# EAGLE design watch_v1_light-addon (EAGLE 9.6.2)
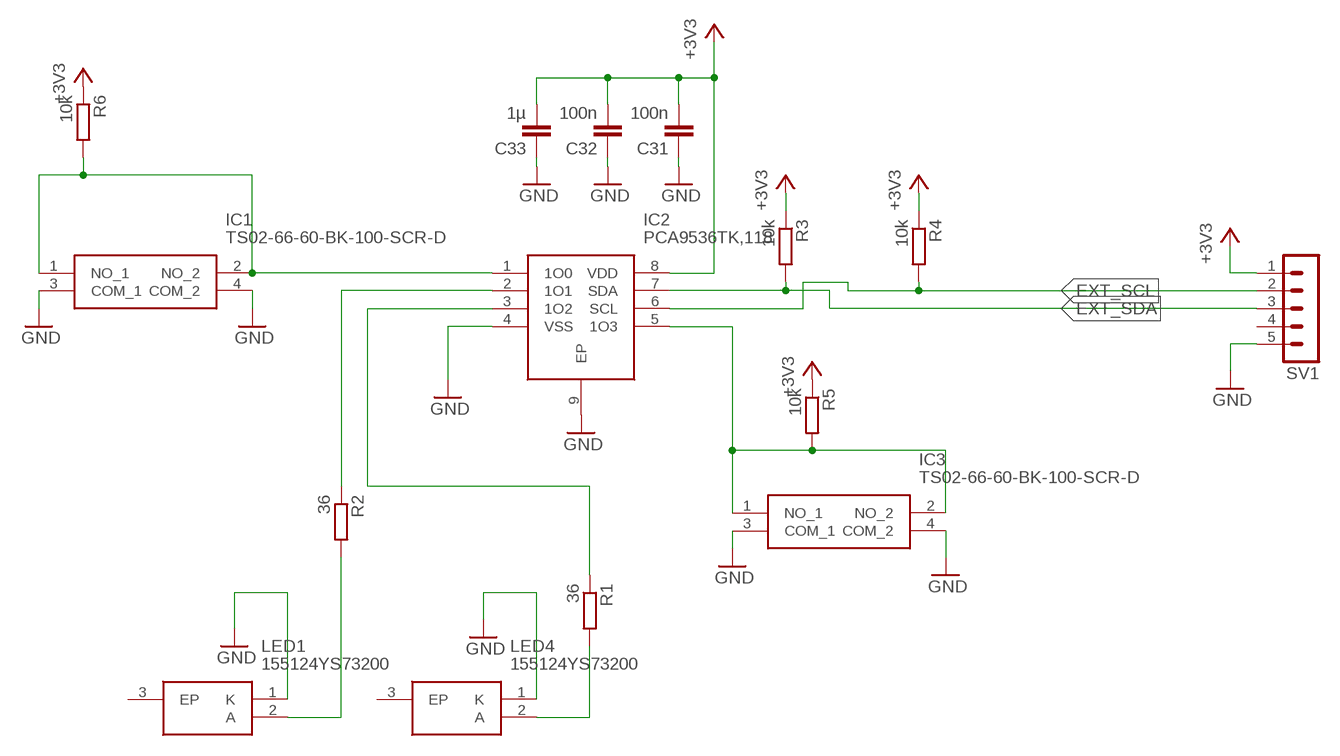
[diagram p0: schematic, sheet 1]

## Parts
C31  100n  C0402_S  [C0402_S]
C32  100n  C0402_S  [C0402_S]
C33  1µ  C0402_S  [C0402_S]
IC1  TS02-66-60-BK-100-SCR-D  [TS026660BK100SCRD]
IC2  PCA9536TK,118  [SON50P300X300X100-9N]
IC3  TS02-66-60-BK-100-SCR-D  [TS026660BK100SCRD]
LED1  155124YS73200  [155124YS73200]
LED4  155124YS73200  [155124YS73200]
R1  36  R0402  [R0402]
R2  36  R0402  [R0402]
R3  10k  R0402  [R0402]
R4  10k  R0402  [R0402]
R5  10k  R0402  [R0402]
R6  10k  R0402  [R0402]
SV1  MA05-1  [MA05-1]

## Nets
+3V3: C31.P$2 C32.P$2 C33.P$2 IC2.8(VDD) R3.1 R4.1 R5.1 R6.1 SV1.1
EXT_SCL: IC2.6(SCL) R4.2 SV1.2
EXT_SDA: IC2.7(SDA) R3.2 SV1.3
GND: C31.P$1 C32.P$1 C33.P$1 IC1.3(COM_1) IC1.4(COM_2) IC2.4(VSS) IC2.9(EP) IC3.3(COM_1) IC3.4(COM_2) LED1.1(K) LED4.1(K) SV1.5
N$1: IC1.1(NO_1) IC1.2(NO_2) IC2.1(1O0) R6.2
N$2: IC2.2(1O1) R2.1
N$3: LED4.2(A) R1.2
N$4: LED1.2(A) R2.2
N$5: IC2.3(1O2) R1.1
N$7: IC2.5(1O3) IC3.1(NO_1) IC3.2(NO_2) R5.2
Unconnected: LED1.3(EP) LED4.3(EP) SV1.4

## Library data of the parts
C31-C33 = moekoe_rcl:C0402
IC1 IC3 = TS02-66-60-BK-100-SCR-D:TS02-66-60-BK-100-SCR-D: 6 x 6 mm, 6 mm Actuator Height, 100 gf, Black, Short Crimped, Through Hole, SPST, Tactile Switch Source: Datasheet <https://www.sameskydevices.com/product/resource/ts02.pdf>; DESCRIPTION: 6 x 6 mm, 6 mm Actuator Height, 100 gf, Black, Short Crimped, Through Hole, SPST, Tactile Switch; HEIGHT: 6.2mm; MANUFACTURER_NAME: Same Sky; MANUFACTURER_PART_NUMBER: TS02-66-60-BK-100-SCR-D; MOUSER_PART_NUMBER: 179-TS026660BK100SCR; MOUSER_PRICE-STOCK: https://www.mouser.co.uk/ProductDetail/Same-Sky/TS02-66-60-BK-100-SCR-D?qs=A6eO%252BMLsxmRCwE7519dLfw%3D%3D
IC2 = PCA9536TK_118:PCA9536TK,118: NXP - PCA9536TK,118 - I/O EXPANDER, 4BIT, 400KHZ, HVSON-8 Source: Datasheet <http://www.nxp.com/docs/en/data-sheet/PCA9536.pdf>; DESCRIPTION: NXP - PCA9536TK,118 - I/O EXPANDER, 4BIT, 400KHZ, HVSON-8; HEIGHT: 1mm; MANUFACTURER_NAME: NXP; MANUFACTURER_PART_NUMBER: PCA9536TK,118; MOUSER_PART_NUMBER: 771-PCA9536TK118; MOUSER_PRICE-STOCK: https://www.mouser.co.uk/ProductDetail/NXP-Semiconductors/PCA9536TK118?qs=LOCUfHb8d9uivcmK3VR1%2Fw%3D%3D
LED1 LED4 = 155124YS73200:155124YS73200: Wurth Elektronik 155124YS73200, WL-SMSW Series Yellow LED, 589 nm, 3210 (1204), Round Lens SMD Package Source: Datasheet <https://www.we-online.com/catalog/datasheet/155124YS73200.pdf>; DESCRIPTION: Wurth Elektronik 155124YS73200, WL-SMSW Series Yellow LED, 589 nm, 3210 (1204), Round Lens SMD Package; HEIGHT: 1.2mm; MANUFACTURER_NAME: Wurth Elektronik; MANUFACTURER_PART_NUMBER: 155124YS73200; MOUSER_PART_NUMBER: 710-155124YS73200; MOUSER_PRICE-STOCK: https://www.mouser.co.uk/ProductDetail/Wurth-Elektronik/155124YS73200?qs=LlUlMxKIyB21jUIV%252Bh2Pcg%3D%3D
R1-R6 = moekoe_rcl:R0402
SV1 = con-lstb:MA05-1: PIN HEADER; OC_FARNELL: unknown; OC_NEWARK: unknown

## Board
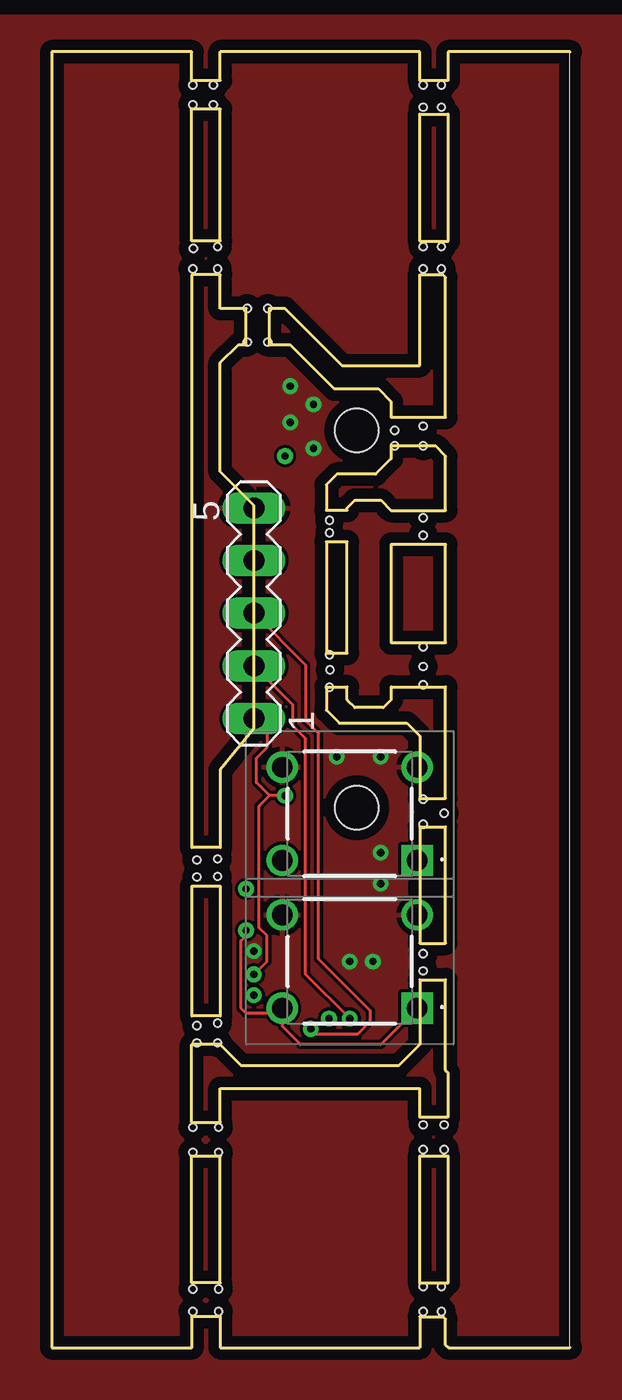
[diagram p1: board, top side]
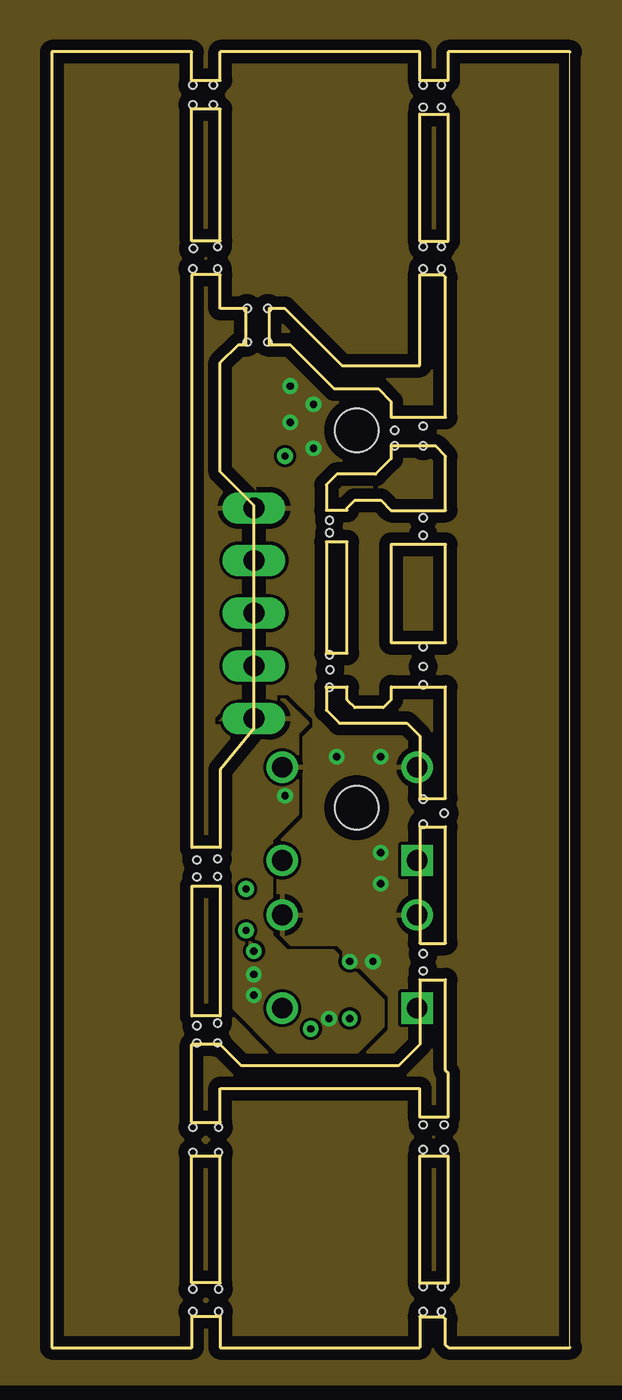
[diagram p2: board, inner layer Route2]
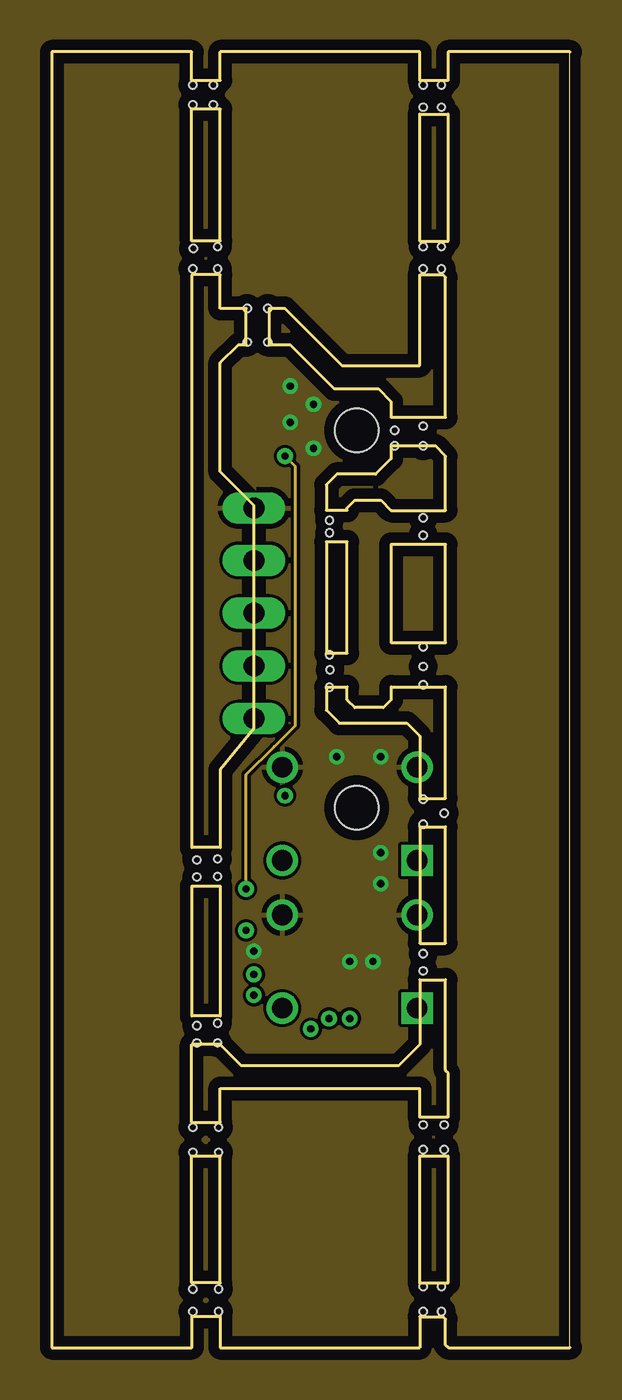
[diagram p3: board, inner layer Route15]
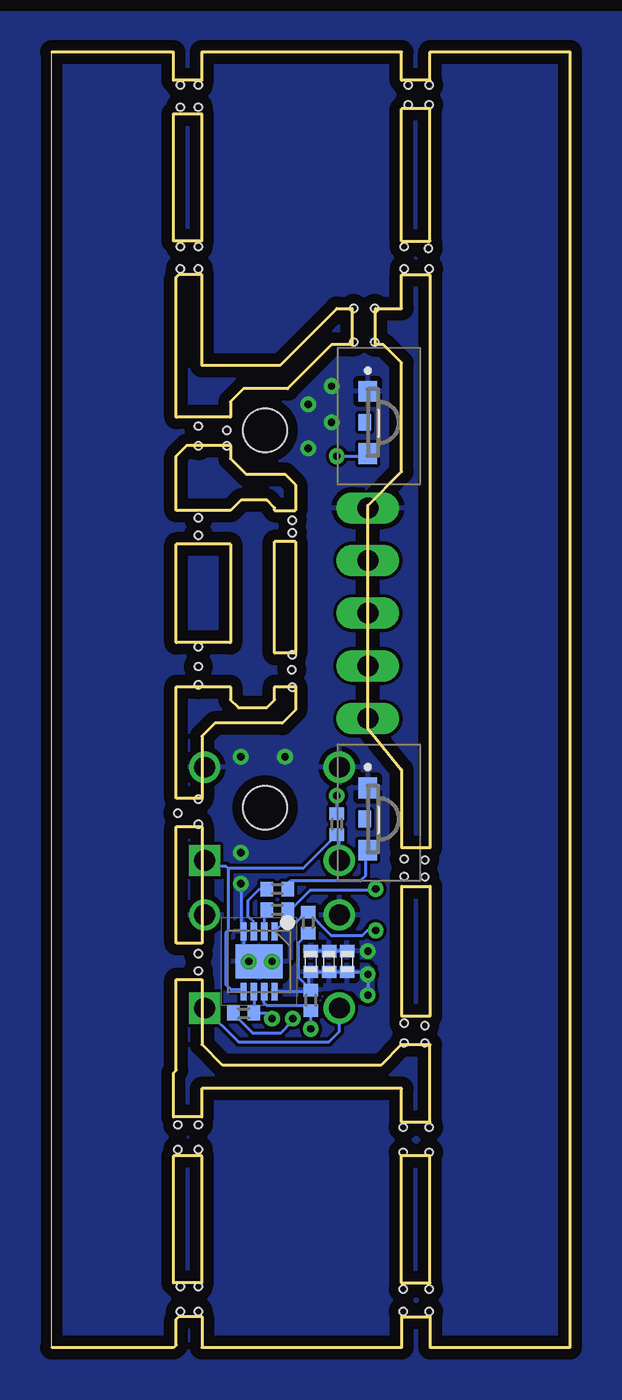
[diagram p4: board, bottom side, seen from below]

Size 25 x 62.5 mm. Coordinates in mm from the lower left corner, seen from the top.
Outline: 9.75,29.88 9.75,40.62 8.12,42.25 8.12,47.5 9,48.38 9.38,48.38 9.38,50.12 8.12,50.12 8.12,51.75 6.75,51.75 6.75,24.12 8.12,24.12 8.12,27.88 9.75,29.88
Outline: 8.12,22.25 8.12,16 6.75,16 6.75,22.25 8.12,22.25
Outline: 10.5,48.38 11.5,48.38 13.62,46.25 15.75,46.25 16.38,45.62 16.38,44.88 19,44.88 19,51.62 18.88,51.75 17.75,51.75 17.75,47.38 14,47.38 11.25,50.12 10.5,50.12 10.5,48.38
Outline: 16.38,43.5 16.38,42.88 15.62,42.12 13.75,42.12 13.25,41.62 13.25,40.38 14.25,40.38 14.25,40.5 14.62,40.88 15.88,40.88 16.38,40.38 19,40.38 19,43 18.5,43.5 16.38,43.5
Outline: 13.88,30.12 17.12,30.12 17.75,29.5 17.75,26.5 19,26.5 19,31.88 16.38,31.88 16.38,31.25 16,30.88 14.62,30.88 14.25,31.25 14.25,31.88 13.25,31.88 13.25,30.75 13.88,30.12
Outline: 13.25,38.88 13.25,33.5 14.25,33.5 14.25,38.88 13.25,38.88
Outline: 8.12,14.62 9.12,13.62 16.75,13.62 17.75,14.62 17.75,17.75 19,17.75 19,13.38 19.12,13.25 19.12,11.12 17.75,11.12 17.75,12.5 8.12,12.5 8.12,10.88 6.75,10.88 6.75,14.62 8.12,14.62
Outline: 17.75,25.12 17.75,19.5 19,19.5 19,25.12 17.75,25.12
Outline: 0,62.5 0,0 6.75,0 6.75,1.5 8.12,1.5 8.12,0 17.75,0 17.75,1.5 18.88,1.5 19,1.38 19,0.12 19.12,0 25,0 25,62.5 19.12,62.5 19.12,61.12 17.75,61.12 17.75,62.5 8.12,62.5 8.12,61.12 6.75,61.12 6.75,62.5 0,62.5
Outline: 19,34 19,38.75 16.38,38.75 16.38,34 19,34
Outline: 17.75,53.38 17.75,59.5 19.12,59.5 19.12,53.38 17.75,53.38
Outline: 6.75,53.38 6.75,59.75 8.12,59.75 8.12,53.38 6.75,53.38
Outline: 17.75,3.12 17.75,9.25 19.12,9.25 19.12,3.12 17.75,3.12
Outline: 6.75,3.12 6.75,9.25 8.12,9.25 8.12,3.12 6.75,3.12
Copper layers (1+2*15+16): Top 0.035mm / dielectric 1.5mm / Route2 0.035mm / dielectric 0.15mm / Route15 0.035mm / dielectric 0.2mm / Bottom 0.035mm
Design rules "default *": minimum track width 6mil, minimum drill 0.35mm, track to track 6mil, track to pad 6mil, pad to pad 6mil, via to via 6mil, smd to smd 6mil, copper to edge 20mil, drill to drill 6mil, minimum pad ring 10mil, minimum via ring 8mil, stop-mask expansion 4mil, vias tented up to drill 0.5mm, thermal gap 10mil
Holes 2.1 mm at 14.71,26.05 14.71,44.25
Holes 0.35 mm at 10.43,50.12 6.83,53.02 6.8,52.02 8,53.1 8,52.02 18.8,52.02 18.8,53.1 17.93,32.85 18.93,25.77 8,15.65 8,14.7 8,23.57 8,22.73 13.4,33.42 13.4,31.85 13.4,39.9 13.4,39.3 6.8,60.9 6.8,59.95 18.8,59.83 18.8,60.9 6.8,10.62 6.8,9.43 6.8,2.82 6.8,1.75 18.8,1.75 18.8,2.95 18.93,9.55 18.93,10.75 17.93,52.02 17.93,53.1 17.93,44.45 17.93,43.5 17.93,40.02 17.93,39.17 17.93,33.8 13.43,32.7 17.93,31.98 17.93,26.45 17.93,25.25 17.93,19 17.93,18.18 17.93,59.83 17.93,60.9 8.05,10.62 8.05,9.43 8.05,2.82 8.05,1.75 17.93,10.75 17.93,9.55 17.93,2.95 17.93,1.75 9.43,50.12 9.43,48.5 10.43,48.5 16.55,43.5 16.55,44.25 7,15.53 7,14.7 7,23.52 7,22.7 7.8,60.9 7.8,59.95

### Footprints (pad centres in the part's own frame; a part is rotated, then mirrored left to right if it is on the bottom)
C0402_S = smd 0.6 x 0.7: P$1 -0.5,0; P$2 0.5,0
TS026660BK100SCRD = drill 1 pad 1.5 square: 1 0,0 | drill 1 pad 1.5: 2 6.5,0; 3 0,-4.5; 4 6.5,-4.5
SON50P300X300X100-9N = smd 0.85 x 0.3: 1 -1.45,0.75; 2 -1.45,0.25; 3 -1.45,-0.25; 4 -1.45,-0.75; 5 1.45,-0.75; 6 1.45,-0.25; 7 1.45,0.25; 8 1.45,0.75 | smd 1.65 x 2.25: 9 0,0
155124YS73200 = smd 1 x 0.9: 1 -1.5,0; 2 1.5,0 | smd 0.8 x 0.6: 3 0,-0.15
R0402 = smd 0.6 x 0.7: 1 -0.5,0; 2 0.5,0
MA05-1 = drill 1.016 long: 1 -5.08,0; 2 -2.54,0; 3 0,0; 4 2.54,0; 5 5.08,0

### Placement (x,y rotation side)
C31  10.75,18.62 270 bottom
C32  11.62,18.62 270 bottom
C33  12.5,18.62 270 bottom
IC1  17.62,16.38 180 top
IC2  15,18.62 270 bottom
IC3  17.62,23.5 180 top
LED1  9.75,44.62 270 bottom
LED4  9.75,25.5 270 bottom
R1  14.12,22.12 0 bottom
R2  14.12,21.12 0 bottom
R3  12.5,16.75 270 bottom
R4  15.75,16.12 0 bottom
R5  11.25,25.25 270 bottom
R6  12.62,20.5 90 bottom
SV1  9.75,35.42 90 top

### Tracks (layer width: path | path; a pad name or v marks a point on that pad's centre or on a via)
+3V3  (via drill 0.35)
  Top 0.152: v9.75,18 10.38,18.62 10.38,19.88 10,20.25 10,26.12 10.5,26.62 | v11.25,26.62 10.5,26.62 | 10.5,26.62 9.88,27.25 9.88,28.44 10.38,28.94 10.38,30 10.03,30.34 SV1.1
  Bottom 0.152: 14.25,16.88 IC2.8 12.7,17.18 12.62,17.25 | 12.62,17.25 12.62,18 C33.P$2 C32.P$2 C31.P$2 9.88,18.12 v9.75,18 v9.75,17 | 12.62,17.25 12.5,17.38 R3.1 13.12,17.88 13.12,19.5 R6.1 | v13.38,15.88 13.38,15.75 13.96,15.17 15.29,15.17 R4.1 | 11.25,25.77 R5.1 v11.25,26.62
  pour Bottom: 9.5,18.25 9.5,16.88 9.62,16.75 10,16.75 10.5,17.25 12,17.25 12.25,17 13.88,17 14.12,16.75 14.38,17 14.38,17.5 13.75,17.5 13.38,17.88 13.38,18.38 13.25,18.5 9.75,18.5
  pour Route2: 8.62,20.75 8.62,16.5 10.88,14.25 14.75,14.25 16,15.5 16,16.75 13.62,19.12 11.38,19.12 10.62,19.88 10.62,24.5 11.88,25.75 11.88,29.62 12.38,30.12 11.25,31.25 9.12,31.25 7.62,29.75 7.62,21.75
EXT_SCL  (via drill 0.35)
  Top 0.152: SV1.2 11.62,31.01 11.62,30 12.25,29.38 12.25,18 v14.38,15.88
  Bottom 0.152: IC2.6 R4.2 14.62,16.12 v14.38,15.88
EXT_SDA  (via drill 0.35)
  Top 0.152: SV1.3 12.25,32.92 12.25,30.25 12.88,29.62 12.88,18.75 15.38,16.25 15.38,15.75 14.77,15.14 12.75,15.14 12.52,15.38 v12.5,15.38
  Bottom 0.152: IC2.7 14.75,16.62 14.62,16.5 12.75,16.5 R3.2 v12.5,15.38
GND  (via drill 0.35)
  Bottom 0.152: C33.P$1 C31.P$1 | IC2.4 15.75,20 | 15.75,20 15.75,18.88 v15.5,18.62 | v15.88,22.38 15.88,20.12 15.75,20
  other vias: 14.38,18.62 9.75,19.12 11.5,46.38 12.62,45.5 11.5,44.62 12.62,43.38 15.88,23.88 15.88,28.5 13.75,28.5
  pour Bottom (rank 2): -2.5,64.41 -2.5,-2.62 39.25,-2.62 42.38,0.5 42.38,64.41
  pour Top (rank 2): -4.25,65.72 -4.25,-4.81 36.12,-4.81 42.5,1.56 42.5,64.22 -3.5,64.22
  pour Route15 (rank 2): -2.88,65.94 -2.88,-4.69 40.25,-4.69 45.75,0.81 45.75,64.31 43.38,66.69 -2.12,66.69
  pour Route2 (rank 2): -3.5,69.19 -3.5,-1.75 8.62,-1.75 38.38,-1.75 38.38,65.94 -1.88,65.94
N$1  (via drill 0.35)
  Top 0.152: IC1.1 15.88,14.62 12,14.62 11.12,15.5 IC1.2 10.88,16.12 9.38,16.12 9.12,16.38 9.12,19.62 9.38,19.88 v9.38,20.12
  Bottom 0.152: IC2.1 13.78,20.55 13.2,20.55 12.75,21 R6.2 12.11,20.48 12.11,20.47 11.53,19.89 10,19.89 9.77,20.12 v9.38,20.12 | IC1.1 16,14.75 11.62,14.75 11.12,15.25 IC1.2
N$2
  Bottom 0.152: IC2.2 14.75,21 R2.1
N$3
  Bottom 0.152: LED4.2 9.88,23.88 9.88,22.75 10.12,22.5 13.47,22.5 13.62,22.35 R1.2
N$4  (via drill 0.35)
  Route15 0.152: v9.38,22.12 9.38,27.64 10.72,28.98 10.73,28.98 11.75,30 11.75,42.5 v11.25,43
  Bottom 0.152: R2.2 13.47,21.12 12.53,22.07 9.43,22.07 v9.38,22.12 | v11.25,43 9.88,43 LED1.2
N$5
  Bottom 0.152: R1.1 14.97,22.12 15.53,21.57 15.53,20.8 15.25,20.53 IC2.3
N$7
  Bottom 0.152: IC2.5 15.82,17.25 16.33,17.25 16.58,17.5 16.58,20.04 16.48,20.14 16.48,23.11 16.5,23.12 | IC3.2 11.12,24.62 R5.2 12.88,23.12 16.5,23.12 | IC3.1 17.33,23.21 16.58,23.21 16.5,23.12